# Altium schematic sheet MCU.SchDoc
size B; SheetNumber: 2; SheetTotal: 4
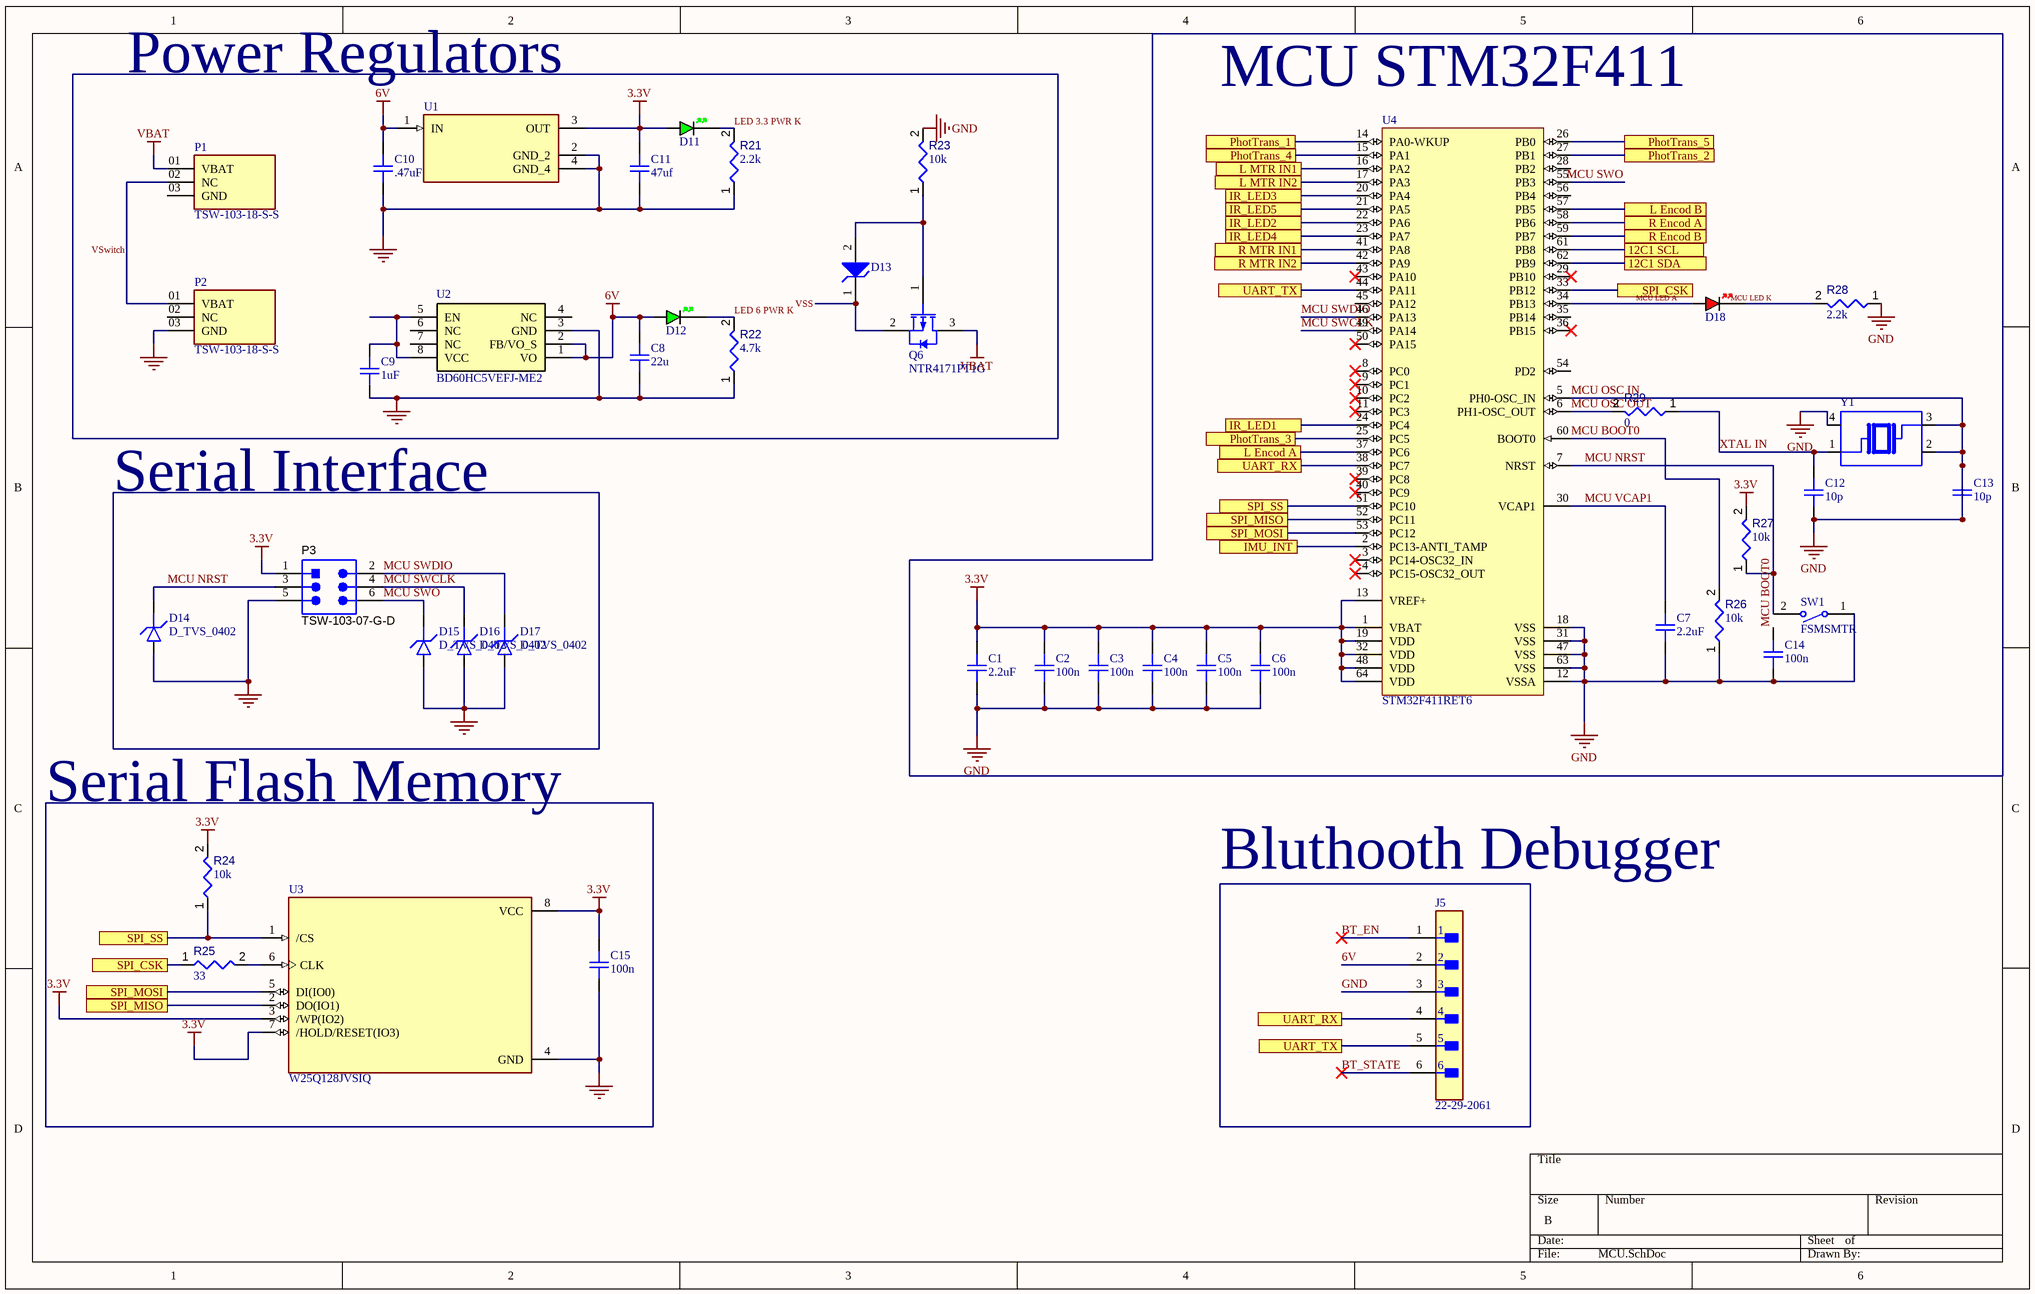
[diagram p0: MCU.SchDoc]

## Parts
C1  2.2uF  [CAP_0603]
C2  100n  [CAP_0603]
C3  100n  [CAP_0603]
C4  100n  [CAP_0603]
C5  100n  [CAP_0603]
C6  100n  [CAP_0603]
C7  2.2uF  [CAP_0603]
C8  22u  [CAP_0805]
C9  1uF  [CAP_0603]
C10  .47uF  [CAP_0603]
C11  47uf  [CAP_1210]
C12  10p  [CAP_0603]
C13  10p  [CAP_0603]
C14  100n  [CAP_0603]
C15  100n  [CAP_0603]
D11  GREEN  [LED_0603_GREEN]  (value not drawn)
D12  GREEN  [LED_0603_GREEN]  (value not drawn)
D13  MMSZ4697T1G  [ONSC-SOD-123-2-425-04_V]  (value not drawn)
D14  D_TVS_0402  [D_0402]
D15  D_TVS_0402  [D_0402]
D16  D_TVS_0402  [D_0402]
D17  D_TVS_0402  [D_0402]
D18  RED  [LED_0603_RED]  (value not drawn)
J5  22-29-2061  [FP-22-29-2061-MFG]
P1  TSW-103-18-S-S  [SAMTEC_TSW-103-18-S-S]
P2  TSW-103-18-S-S  [SAMTEC_TSW-103-18-S-S]
P3  TSW-103-07-G-D  [SMTC-TSW-103-07-G-D_V]
Q6  NTR4171PT1G  [ONSC-SOT-23-3-318-08_V]
R21  value 2.2k  [RESC0402(1005)_L]  (hidden comment: 324KR2F)
R22  value 4.7k  [RESC0402(1005)_L]  (hidden comment: 324KR2F)
R23  value 10k  [RESC0402(1005)_L]  (hidden comment: 324KR2F)
R24  value 10k  [RESC0402(1005)_L]  (hidden comment: 324KR2F)
R25  value 33  [RESC0402(1005)_L]  (hidden comment: 324KR2F)
R26  value 10k  [RESC0402(1005)_L]  (hidden comment: 324KR2F)
R27  value 10k  [RESC0402(1005)_L]  (hidden comment: 324KR2F)
R28  value 2.2k  [RESC0402(1005)_L]  (hidden comment: 324KR2F)
R29  value 0  [RESC0402(1005)_L]  (hidden comment: 324KR2F)
SW1  FSMSMTR  [TECO-FSMSMTR_V]
U1  (no value)  [VREG_LM3940IMP-3.3/NOPB]
U2  BD60HC5VEFJ-ME2  [TSOP127P600X100_HS-9N]
U3  W25Q128JVSIQ  [SOIC127P790X216-8N]
U4  STM32F411RET6  [STM-LQFP64_L]
Y1  TSX-322524.0000MF15X-AC3  [OSCCC320X250X60]  (value not drawn)

## Ports
12C1 SCL, 12C1 SDA, IMU_INT, IR_LED1, IR_LED2, IR_LED3, IR_LED4, IR_LED5, L Encod A, L Encod B, L MTR IN1, L MTR IN2, PhotTrans_1, PhotTrans_2, PhotTrans_3, PhotTrans_4, PhotTrans_5, R Encod A, R Encod B, R MTR IN1, R MTR IN2, SPI_CSK, SPI_MISO, SPI_MOSI, SPI_SS, UART_RX, UART_TX

## Nets
3.3V: C1.2 C2.2 C3.2 C4.2 C5.2 C6.2 C11.2 C15.2 D11.A P3.1 R24.2 R27.2 U1.3(OUT) U3.3(/WP(IO2)) U3.7(/HOLD/RESET(IO3)) U3.8(VCC) U4.1(VBAT) U4.13(VREF+) U4.19(VDD) U4.32(VDD) U4.48(VDD) U4.64(VDD)
6V: C8.2 C10.2 D12.A J5.2 U1.1(IN) U2.1(VO) U2.2(FB/VO_S)
GND: C1.1 C2.1 C3.1 C4.1 C5.1 C6.1 C7.1 C8.1 C9.1 C10.1 C11.1 C12.1 C13.1 C13.2 C14.1 C15.1 D14.A D15.A D16.A D17.A J5.3 P2.03(GND) P3.5 R21.1 R22.1 R23.2 R26.1 R28.1 SW1.1 U1.2(GND_2) U1.4(GND_4) U2.3(GND) U3.4(GND) U4.5(PH0-OSC_IN) U4.12(VSSA) U4.18(VSS) U4.31(VSS) U4.47(VSS) U4.63(VSS) Y1.2 Y1.3 Y1.4  [also labelled MCU OSC IN]
VBAT: P1.01(VBAT) Q6.3(D)
12C1 SCL: U4.61(PB8) ; port 12C1 SCL
12C1 SDA: U4.62(PB9) ; port 12C1 SDA
BT_EN: J5.1
BT_STATE: J5.6
IMU_INT: U4.2(PC13-ANTI_TAMP) ; port IMU_INT
IR_LED1: U4.24(PC4) ; port IR_LED1
IR_LED2: U4.22(PA6) ; port IR_LED2
IR_LED3: U4.20(PA4) ; port IR_LED3
IR_LED4: U4.23(PA7) ; port IR_LED4
IR_LED5: U4.21(PA5) ; port IR_LED5
L Encod A: U4.37(PC6) ; port L Encod A
L Encod B: U4.57(PB5) ; port L Encod B
L MTR IN1: U4.16(PA2) ; port L MTR IN1
L MTR IN2: U4.17(PA3) ; port L MTR IN2
LED 3.3 PWR K: D11.K R21.2
LED 6 PWR K: D12.K R22.2
MCU BOOT0: C14.2 R26.2 U4.60(BOOT0)
MCU LED A: D18.A U4.34(PB13)
MCU LED K: D18.K R28.2
MCU NRST: D14.K P3.3 R27.1 SW1.2 U4.7(NRST)
MCU OSC OUT: R29.2 U4.6(PH1-OSC_OUT)
MCU SWCLK: D16.K P3.4 U4.49(PA14)
MCU SWDIO: D17.K P3.2 U4.46(PA13)
MCU SWO: D15.K P3.6 U4.55(PB3)
MCU VCAP1: C7.2 U4.30(VCAP1)
PhotTrans_1: U4.14(PA0-WKUP) ; port PhotTrans_1
PhotTrans_2: U4.27(PB1) ; port PhotTrans_2
PhotTrans_3: U4.25(PC5) ; port PhotTrans_3
PhotTrans_4: U4.15(PA1) ; port PhotTrans_4
PhotTrans_5: U4.26(PB0) ; port PhotTrans_5
R Encod A: U4.58(PB6) ; port R Encod A
R Encod B: U4.59(PB7) ; port R Encod B
R MTR IN1: U4.41(PA8) ; port R MTR IN1
R MTR IN2: U4.42(PA9) ; port R MTR IN2
SPI_CSK: R25.1 U4.33(PB12) ; port SPI_CSK
SPI_MISO: U3.2(DO(IO1)) U4.52(PC11) ; port SPI_MISO
SPI_MOSI: U3.5(DI(IO0)) U4.53(PC12) ; port SPI_MOSI
SPI_SS: R24.1 U3.1(/CS) U4.51(PC10) ; port SPI_SS
UART_RX: J5.4 U4.38(PC7) ; port UART_RX
UART_TX: J5.5 U4.44(PA11) ; port UART_TX
VSS: D13.1(K) Q6.2(S)
VSwitch: P1.02(NC) P2.01(VBAT)
XTAL IN: C12.2 R29.1 Y1.1
NetC9_2: C9.2 U2.5(EN) U2.8(VCC)
NetD13_2: D13.2(A) Q6.1(G) R23.1
NetR25_2: R25.2 U3.6(CLK)

Not connected (* = marked no-connect by the designer): P1 03(GND); P2 02(NC); U2 4(NC) 6(NC) 7(NC); U4 3(PC14-OSC32_IN)* 4(PC15-OSC32_OUT)* 8(PC0)* 9(PC1)* 10(PC2)* 11(PC3)* 28(PB2) 29(PB10)* 35(PB14) 36(PB15)* 39(PC8)* 40(PC9)* 43(PA10)* 45(PA12) 50(PA15)* 54(PD2) 56(PB4)

## Notes on the sheet
- (near U1) Power Regulators
- (near U4) MCU STM32F411
- Serial Interface
- (near R24) Serial Flash Memory
- Bluthooth Debugger

## Library data of the parts
C1-C7 C9 C10 C12-C15 = CAP_0603: Capacitor SMD 0603; Manufacturer: *; Manufacturer Part Number: *; Distributor Link: *; LCSC: *; Rating: *; Dielectric: *
C8 = CAP_0805: Capacitor SMD 0805; Manufacturer: *; Manufacturer Part Number: *; Distributor Link: *; LCSC: *; Rating: *; Dielectric: *
C11 = CAP_1210: Capacitor SMD 1210; Manufacturer: *; Manufacturer Part Number: *; Distributor Link: *; LCSC: *; Rating: *; Dielectric: *
D11 D12 = LED_0603_GREEN: LED 0603 GREEN SMD
D13 = CMP-1060-00438-1: Zener Voltage Regulator, 500 mW, 2-Pin SOD-123, Pb-Free, Tape and Reel; Manufacturer: On Semiconductor; VZ Typ (V): 10; P Max (W): 0.5; ComponentLink3Description: Package Specification; ComponentLink3URL: http://www.onsemi.com/pub_link/Collateral/425-04.PDF; ComponentLink2Description: Datasheet; Packing: Tape and Reel; RoHS: Pb-Free; DatasheetVersion: Rev. 9; PackageVersion: Rev. G, 10/2009; ComponentLink2URL: http://www.onsemi.com/pub_link/Collateral/MMSZ4678T1-D.PDF; ComponentLink1URL: http://www.onsemi.com/; PackageReference: SOD-123-2-425-04; PackageDescription: 2-Pin SOD, Body 1.6 x 2.69 mm; PartNumber: MMSZ4697T1G; Mounting Technology: Surface Mount; ComponentLink1Description: Manufacturer URL
D14-D17 = D_TVS_0402: Diode TVS / ESD 0402
D18 = LED_0603_RED: LED 0603 RED SMD
J5 = CMP-04776-000348-1: CONN HEADER VERT 6POS 2.54MM; Gender: Male; Number of Poles: 6; Voltage Rating: 250V; Insulation Resistance: 50GR; Contact Resistance: 10mR; Current Rating: 4A; Number of Lines: 1; Height: 11.7mm; Mount: Through Hole; Length: 15.24mm; Contact Plating: Gold; Contact Type: Male Pin; Contact Material: Brass; Housing Material: Nylon; Series: KK® 6410; Number of Positions: 6; Contact Mating Length: 0.295inch; Fastening Type: Friction; RoHS Compliant: Yes; Color: Natural; Max Operating Temperature: 75°C; Contact Gender: Male; Packaging: Bulk; Termination: Solder; Voltage Rating (DC): 250V; Orientation: Straight; Radiation Hardening: No; Flammability Rating: UL94 V-0; Package Quantity: 1000; Housing Color: White; Number of Rows: 1; Min Operating Temperature: 0°C; Max Current Rating: 4A; Pitch: 2.54mm; Depth: 5.8mm; Number of Contacts: 6; Lead Free: Lead Free
P3 = CMP-2000-07329-1: Through Hole Header, Pitch 2.54 mm, 2 x 3 Position, Height 8.58 mm, Tail Length 2.54 mm, -55 to 125 degC, RoHS, Bulk; Manufacturer: Samtec-Inc.; Number of Positions Loaded: All; Number of Positions: 6; Row Spacing: 0.100"(2.54mm); Connector Type: Header,Unshrouded; Package Reference: TSW-103-07-G-D; Termination: Solder; Manufacturer URL: http://www.samtec.com/; Contact Finish: Gold; Contact Mating Length: 0.230"(5.84mm); Package Description: Through Hole Header, Pitch 2.54 mm, 2 x 3 Position, Height 8.58 mm, Tail Length 2.54 mm; Datasheet Version: 12/2015; Number of Rows: 2; Features: -; Family: RectangularConnectors-Headers,MalePins; Fastening Type: -; Datasheet URL: http://suddendocs.samtec.com/catalog_english/tsw_th.pdf; Category: Connectors,Interconnects; Package URL: http://suddendocs.samtec.com/prints/tsw-xxx-xx-xxx-x-xx-xxx-mkt.pdf; Mounting Type: ThroughHole; Contact Finish Thickness: 10µin(0.25µm); Packaging: Bulk; Color: Black; Pitch: 0.100"(2.54mm); Series: TSW; Contact Type: MalePin; Mounting Technology: ThroughHole
Q6 = CMP-1058-00738-1: Power MOSFET, -30 V, 3.5 A, Single P-Channel, 3-Pin SOT-23, Pb-Free, Tape and Reel; Manufacturer: On Semiconductor; VGS Max (V): 12; V(BR)DSS Min (V): 30; Crss Typ (pF): 65; VGS(th) Max (V): 1.4; Ciss Typ (pF): 720; Qrr Typ (nC): 8; Coss Typ (pF): 95; Channel Polarity: P Channel; ComponentLink2URL: http://www.onsemi.cn/pub_link/Collateral/NTR4171P-D.PDF; ComponentLink1Description: Manufacturer URL; PartNumber: NTR4171PT1G; Mounting Technology: Surface Mount; ComponentLink1URL: http://www.onsemi.com/; Packing: Tape and Reel; Package Type: SOT-23-3; ComponentLink2Description: Datasheet; PackageReference: SOT-23-3-318-08; Configuration: Single; ComponentLink3Description: Package Specification; DatasheetVersion: Rev. 1; PackageVersion: Rev. AP, 11/2009; RoHS: Pb-Free; PackageDescription: 3-Pin Small Outline Transistor, Body 2.92 x 1.3 mm, Pitch 0.95 mm; ComponentLink3URL: http://www.onsemi.cn/pub_link/Collateral/318-08.PDF
R21-R29 = CMP-009-00094-2: 324K 0.063W 1% 0402 (1005 Metric)  SMD; Power: 63mW; Tolerance: 1%; Pins: 2; Mounting Technology: SMT; Case/Package: 0402
SW1 = CMP-2000-07501-1: FSMSM Push Button Switch, 50 mA, -35 to 85 degC, 2-Pin SMD, RoHS, Tape and Reel; Manufacturer: TE Connectivity; Voltage Rating (DC): 24V; Electrical Life: 20000Cycles; Operating Force: 180gf; Switch Travel: 0.25mm; Contact Current Rating: 50mA; Case\/Package: SMD/SMT; Actuator Length: 1.07mm; Throw Configuration: SPST; Actuator Material: Polyamide; Contact Resistance: 100mOhm; Illumination Type: Illuminated; Max Voltage Rating (DC): 12V; Manufacturer URL: http://www.te.com/; Lead Free: LeadFree; Packaging: TapeandReel; Min Operating Temperature: -35degC; Mechanical Life: 20000Cycles; Mount: SurfaceMount; REACH SVHC: Unknown; Package Quantity: 1800; Package Reference: FSMSMTR; RoHSCompliant: true; Max Operating Temperature: 85degC; Orientation: Straight; ELV: Compliant; Datasheet URL: http://www.te.com/commerce/DocumentDelivery/DDEController?Action=showdoc&DocId=Customer+Drawing%7F1437566-3%7FC2%7Fpdf%7FEnglish%7FENG_CD_1437566-3_C2_1437566_3_1_c.dwg.pdf%7F1437566-4; Package Description: 2-Pin Surface Mount Device, Body 6 x 3.5 mm, Pitch 9.19 mm; Current Rating: 50mA; Contact Plating: Silver; Termination: GullWing; Datasheet Version: Rev. C2, 08/2014; Contact Material: Brass; Mounting Technology: SurfaceMount
U1 = LM3940IMP-3.3/NOPB: Ð›Ð¸Ð½ÐµÐ¹Ð½Ñ‹Ð¹ ÑÑ‚Ð°Ð±Ð¸Ð»Ð¸Ð·Ð°Ñ‚Ð¾Ñ€ Ð½Ð°Ð¿Ñ€ÑÐ¶ÐµÐ½Ð¸Ñ IC 1 Output 1A SOT-223-4; MP: LM3940IMP33; MF: National Semiconductor; SnapEDA_Link: https://www.snapeda.com/parts/LM3940IMP33/Texas%20Instruments/view-part/21631/?ref=snap; Value: *; Availability: Unavailable; Package: SOT-223-4 National Semiconductor; Check_prices: https://www.snapeda.com/parts/LM3940IMP33/Texas%20Instruments/view-part/21631/?ref=eda; Price: None
U2 = BD60HC5VEFJ-ME2: Linear Voltage Regulator IC Positive Fixed 1 Output 1.5A 8-HTSOP-J; Manufacturer: Rohm; Supplier: Newark; Supplier Part Number: 78AK2890; Manufacturer Part Number: BD60HC5VEFJ-ME2; RoHS: No; Stock: 100; Pricing: 1=1.41, 10=1.25, 25=1.19, 50=1.08, 100=0.978, 250=0.914, 500=0.808, 1000=0.638 (USD)
U3 = CMP-031-00006-1: FLASH - NOR Memory IC 128Mb (16M x 8) SPI - Quad I/O, QPI, DTR 133 MHz 8-SOIC; MF: Winbond Electronics; Component Type: Standard; Check_prices: https://www.snapeda.com/parts/W25Q128JVSIQ/Winbond/view-part/?ref=eda; Design Item ID: W25Q128JVSIQ; Pins: 8; Value: *; Source: W25Q128JVSIQ.SchLib; Case/Package: SOIC-8 Winbond Electronics; SnapEDA_Link: https://www.snapeda.com/parts/W25Q128JVSIQ/Winbond/view-part/?ref=snap; MP: W25Q128JVSIQ
U4 = CMP-0243-00169-1: ARM Cortex-M4 32-bit MCU+FPU, 512 KB Flash, 128 KB RAM, 50 I/Os, 64-Pin LQFP, -40 to 85 degC, Tray; Operating Frequency(F) (Processor speed) (MHz): 100; FLASH Size (Prog) (kB): 512; Supply Voltage(Vcc) min (V): 1.7; Internal RAM Size (kB): 128; I/Os (High Current): 50; Packing: Tray; ComponentLink1Description: Manufacturer URL; Package Description: LQFP64; DatasheetVersion: Rev. 6; Mounting Technology: Surface Mount; Package Reference: 64-Pin Low-profile Quad Flat Package, Body 10 x 10 mm, Pitch 0.5 mm; ComponentLink2Description: Datasheet; Core: ARM Cortex-M4; ComponentLink2URL: http://www.st.com/st-web-ui/static/active/en/resource/technical/document/datasheet/DM00115249.pdf; ComponentLink1URL: http://www.st.com/
Y1 = TSX-322524.0000MF15X-AC3: 24MHz Â±10ppm Crystal 9pF 40 Ohms 4-SMD, No Lead; MF: EPSON; Availability: Unavailable; Value: *; Package: SMD-4 EPSON; Price: None; SnapEDA_Link: https://www.snapeda.com/parts/TSX-3225%2024.0000MF15X-AC3/EPSON/view-part/230042/?ref=snap; MP: TSX-3225 24.0000MF15X-AC3